# Altium schematic sheet main.SchDoc
size A; SheetNumber: 1; SheetTotal: 1
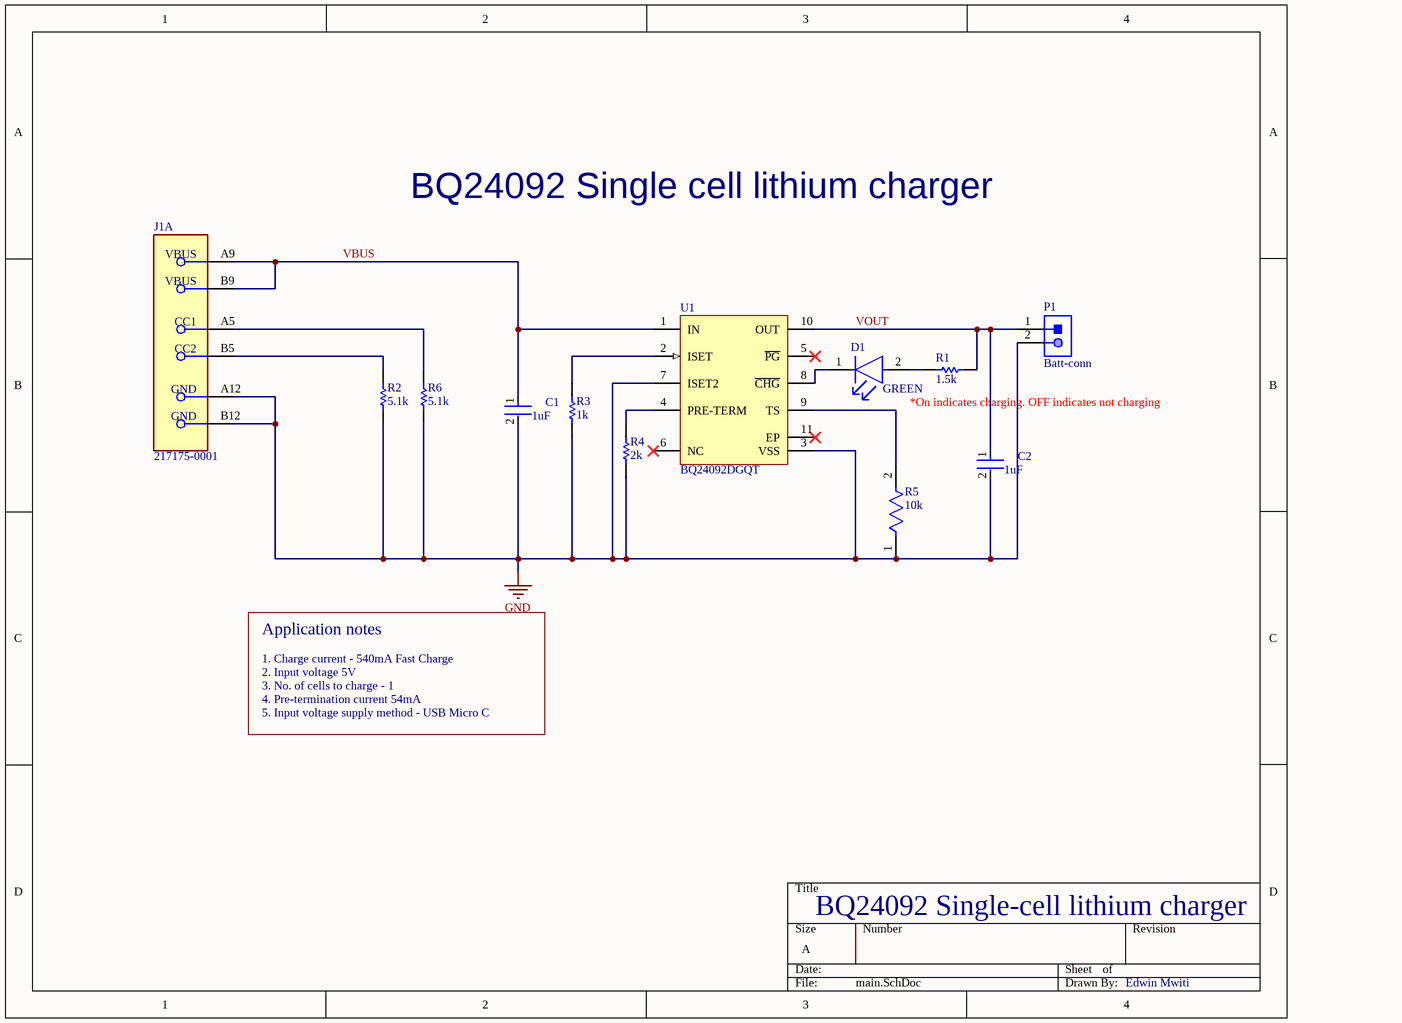
[diagram p0: main.SchDoc]

## Parts
C1  1uF  [FP-CC0805-0_85-MFG]
C2  1uF  [FP-CC0805-0_85-MFG]
D1  GREEN  [FP-SML-210-MFG]
J1  217175-0001  [FP-217175-0001-MFG]  (part A of 2)
P1  Batt-conn  [JST-S2B-PH-K-S_V]
R1  1.5k  [RESC2013X60X40ML20T25]
R2  5.1k  [RESC2013X70X40LL20T20]
R3  1k  [RESC2013X70X40ML20T20]
R4  2k  [RESC2013X60X35LL10T20]
R5  10k  [FP-CRCW0805-e3-IPC_A]
R6  5.1k  [RESC2013X70X40LL20T20]
U1  BQ24092DGQT  [DGQ0010D_M]

## Nets
GND: C1.2 C2.2 J1.A12(GND) J1.B12(GND) P1.2 R2.1 R3.1 R4.1 R5.1 R6.1 U1.3(VSS) U1.7(ISET2)
VBUS: C1.1 J1.A9(VBUS) J1.B9(VBUS) U1.1(IN)
VOUT: C2.1 P1.1 R1.1 U1.10(OUT)
NetD1_1: D1.1(C) U1.8(~{CHG})
NetD1_2: D1.2(A) R1.2
NetJ1_A5: J1.A5(CC1) R6.2
NetJ1_B5: J1.B5(CC2) R2.2
NetR3_2: R3.2 U1.2(ISET)
NetR4_2: R4.2 U1.4(PRE-TERM)
NetR5_2: R5.2 U1.9(TS)

Not connected (* = marked no-connect by the designer): U1 5(~{PG})* 6(NC)* 11(EP)*

## Notes on the sheet
- BQ24092 Single cell lithium charger
- *On indicates charging. OFF indicates not charging
- Application notes
- 1. Charge current - 540mA Fast Charge
- 2. Input voltage 5V
- 3. No. of cells to charge - 1
- 4. Pre-termination current 54mA
- 5. Input voltage supply method - USB Micro C
- BQ24092 Single-cell lithium charger
- Edwin Mwiti

## Library data of the parts
C1 C2 = CMP-03422-000001-1: CAP CER 1UF 16V X7R 0805; Manufacturer: Yageo; Manufacturer Part Number: CC0805KKX7R7BB105; Material: Ceramic; Tolerance: 0.1; Voltage Rating: 16 V; Category: Cap; Capacitance: 1 uF; ComponentLink2Description: Datasheet; Automotive: No; Temperature Range High: +85°C; RoHS: TRUE; Footprint Url: http://www.yageo.com/exep/pages/download/literatures/UPY-C_GEN_24.pdf; Mouser Description: Multilayer Ceramic Capacitors MLCC - SMD/SMT 1.0uF 16V X7R 10%; Height: 0.95mm; Ipc Land Pattern Name: CAPC200125X85; Temperature: -30°C to +85°C; Lead Free: Yes; Value: 1 uF; Temperature Characteristic: X7R; Package: CC0805-0.85; Temperature Range Low: -30°C; Device Class L1: Passive Components; Device Class L3: Ceramic Capacitors; Octopart: https://octopart.com/cc0805kkx7r7bb105-yageo-8376555; ComponentLink2URL: http://www.yageo.com/documents/recent/UPY-GPHC_Y5V_6.3V-to-50V_8.pdf; Device Class L2: Capacitors; Digikey Description: CAP CER 1UF 16V X7R 0805
D1 = CMP-08952-000013-1: LED GREEN CLEAR 0805 SMD; Manufacturer Part Number: SML-210MTT86; Manufacturer: ROHM; Forward Current: 20mA; Reverse Voltage: 4V; Peak Emmision Wavelength: 573nm; Forward Voltage: 2.2V; Luminous Intensity: 16mcd; Power Dissipation: 70mW; Led Orientation: Top View; Wavelength: 570nm; Device Class L2: LEDs; Colour: Green; Height: 0.90mm; Ipc Land Pattern Name: DIOCP200125X25; Automotive: No; Temperature Range High: +85°C; Device Class L3: unset; Temperature: -30°C to +85°C; Device Class L1: Optoelectronics; Mouser Description: Standard LEDs - SMD GREEN SMD TRANS LENS; Temperature Range Low: -30°C; Package: SML-210; Digikey Description: LED GREEN CLEAR 0805 SMD; Lead Free: Yes; ComponentLink2URL: https://www.mouser.in/ds/2/348/sml-21-313092.pdf; ComponentLink2Description: Datasheet; Octopart: https://octopart.com/sml-210mtt86-rohm-550711; RoHS: TRUE; Category: Diode
J1 = CMP-04767-000026-1: CONN RCP USB2.0 C 6+18P SMD RA
P1 = CMP-1755-00004-1: Male Header, Pitch 2 mm, 1 x 2 Position, Height 4.8 mm, Tail Length 3.4 mm, -25 to 85 degC, RoHS, Bulk; Case\Package: Radial; Tolerance: 20%; Capacitance: 10 uF; Voltage Rating (DC): 50 V; Packaging: Bulk; ComponentLink1URL: http://www.jst-mfg.com/product/pdf/eng/ePH.pdf; Radiation Hardening: No; Height: 11 mm; Package Quantity: 200; PackageDescription: Male Header, Pitch 2 mm, 1 x 2 Position, Height 4.8 mm, Tail Length 3.4 mm; PackageReference: S2B-PH-K-S; Diameter: 5 mm; Pins: 2; Mount: Through Hole; Max Operating Temperature: 85 degC; Min Operating Temperature: -40 degC; ComponentLink1Description: Datasheet; DatasheetVersion: Dec-12; Length: 11 mm; Lead Pitch: 2 mm; REACH SVHC: No SVHC; Voltage Rating: 50 V; RoHSCompliant: true
R1 = CMP-2001-00597-1: Manufacturer: Panasonic; Part Number: ERA6AEB152V
R2 R6 = CMP-2001-00427-1: Manufacturer: Panasonic; Part Number: ERJ-6GEYJ512V
R3 = CMP-2001-04375-5: Chip Resistor, 1 KOhm, +/- 1%, 0.125 W, -55 to 155 degC, 0805 (2012 Metric), RoHS, Tape and Reel; Manufacturer: Panasonic; Voltage Rating: 150 V; ComponentLink1URL: http://www.panasonic.com/; ComponentLink2Description: Datasheet; REACH SVHC: Yes; ComponentLink1Description: Manufacturer URL; Length: 2 mm; Height: 0.6 mm; Package Quantity: 1; PackageDescription: 2-Pin Surface Mount Device, Body 2 x 1.25 mm; Packaging: Cut Tape; PackageReference: 0805; Max Operating Temperature: 155 degC; Mounting Technology: Surface Mount; ComponentLink2URL: http://industrial.panasonic.com/cdbs/www-data/pdf/RDA0000/AOA0000C86.pdf; DatasheetVersion: 04/2015; Min Operating Temperature: -55 degC; RoHSCompliant: true; Mount: Surface Mount
R4 = CMP-2001-01361-1: Manufacturer: Yageo; Part Number: RC0805JR-072KL
R5 = CMP-2001-04908-2: RES Thick Film, 10kΩ, 1%, 0.125W, 100ppm/°C, 0805; Resistance: 10kR; Voltage Rating (DC): 150V; Power Rating: 125mW; Weight: 0.000194oz; Package Quantity: 5000; Military Standard: Not; Max Operating Temperature: 155°C; Temperature Coefficient: 100ppm/°C; Contact Plating: Tin; Width: 1.25mm; Height: 0.45mm; Radiation Hardening: No; Tolerance: 1%; Min Operating Temperature: -55°C; Voltage Rating: 150V; Length: 2mm; Depth: 1.25mm; Termination: SMD/SMT; Packaging: Tape and Reel; Case/Package: 0805; Case Code (Metric): 2012; Lead Free: Lead Free; Case Code (Imperial): 0805; Composition: Thick Film
U1 = CMP-0321-00905-2: 1 A, Single-Input, Single-Cell Li-Ion Battery Charger with Operation Over JEITA and 10 k ohm NTC, 4.5 V, -40 to 150 degC, 10-pin MSOP-PowerPAD (DGQ), Green (RoHS & no Sb/Br); Manufacturer: Texas Instruments; Over Voltage Protection: N; SubFamily: Battery Charge Management; Vin(Min)(V): 4.5; Eco-Plan: Green (RoHS & no Sb/Br); DatasheetVersion: SLUS968C; ComponentLink1URL: http://www.ti.com/general/docs/lit/getliterature.tsp?genericPartNumber=BQ24092&fileType=pdf; NiMH: N; Lead Acid: N; Li-Ion: N; Mounting Technology: Surface Mount; NiCd: N; PackageVersion: revF, Nov-2011; Code_JEDEC: MO-187-BA-T; ComponentLink1Description: Datasheet; PartNumber: BQ24092DGQT; Li-Polymer: N; PackageDescription: 10-Pin PowerPAD Plastic Small Outline 0.5 mm Pitch, Exposed Pad; PackageReference: DGQ0010D